# Altium schematic sheet DriverSchematic.SchDoc
size A4; SheetNumber: 2; SheetTotal: 2; SPICEModelCacheHSHRDFLH: <root> / <DocumentId>HSHRDFLH</DocumentId> / <CacheFrame Number="0"> / <Model Name="irf540n" Kind="CKT"> / <Text>.SUBCKT irf540n 1 2 3 / * SPICE3 MODEL WITH THERMAL RC NETWORK / ************************************** / *      Model Generated by MODPEX     * / *Copyright(c) Symmetry Design Systems* / *         All Rights Reserved        * / *    UNPUBLISHED LICENSED SOFTWARE   * / *   Contains Proprietary Information * / *      Which is The Property of      * / *     SYMMETRY OR ITS LICENSORS      * / *Commercial Use or Resale Restricted * / *   by Symmetry License Agreement    * / ************************************** / * Model generated on Sep  5, 01 / * MODEL FORMAT: SPICE3 / * Symmetry POWER MOS Model (Version 1.0) / * External Node Designations / * Node 1 -&gt; Drain / * Node 2 -&gt; Gate / * Node 3 -&gt; Source / M1 9 7 8 8 MM L=100u W=100u / .MODEL MM NMOS LEVEL=1 IS=1e-32 / +VTO=3.58173 LAMBDA=0.00806114 KP=112.25 / +CGSO=1.896e-05 CGDO=1e-11 / RS 8 3 0.025918 / D1 3 1 MD / .MODEL MD D IS=1.565e-11 RS=0.006486 N=1.1328 BV=100 / +IBV=0.00025 EG=1.2 XTI=3.32496 TT=0 / +CJO=1.16e-09 VJ=3.16363 M=0.840542 FC=0.5 / RDS 3 1 1e+06 / RD 9 1 0.0130608 / RG 2 7 6.45271 / D2 4 5 MD1 / * Default values used in MD1: / *   RS=0 EG=1.11 XTI=3.0 TT=0 / *   BV=infinite IBV=1mA / .MODEL MD1 D IS=1e-32 N=50 / +CJO=1.30485e-09 VJ=0.899032 M=0.9 FC=1e-08 / D3 0 5 MD2 / * Default values used in MD2: / *   EG=1.11 XTI=3.0 TT=0 CJO=0 / *   BV=infinite IBV=1mA / .MODEL MD2 D IS=1e-10 N=0.4 RS=3e-06 / RL 5 10 1 / FI2 7 9 VFI2 -1 / VFI2 4 0 0 / EV16 10 0 9 7 1 / CAP 11 10 2.35428e-09 / FI1 7 9 VFI1 -1 / VFI1 11 6 0 / RCAP 6 10 1 / D4 0 6 MD3 / * Default values used in MD3: / *   EG=1.11 XTI=3.0 TT=0 CJO=0 / *   RS=0 BV=infinite IBV=1mA / .MODEL MD3 D IS=1e-10 N=0.4 / .ENDS irf540n</Text> / </Model> / </CacheFrame> / </root>
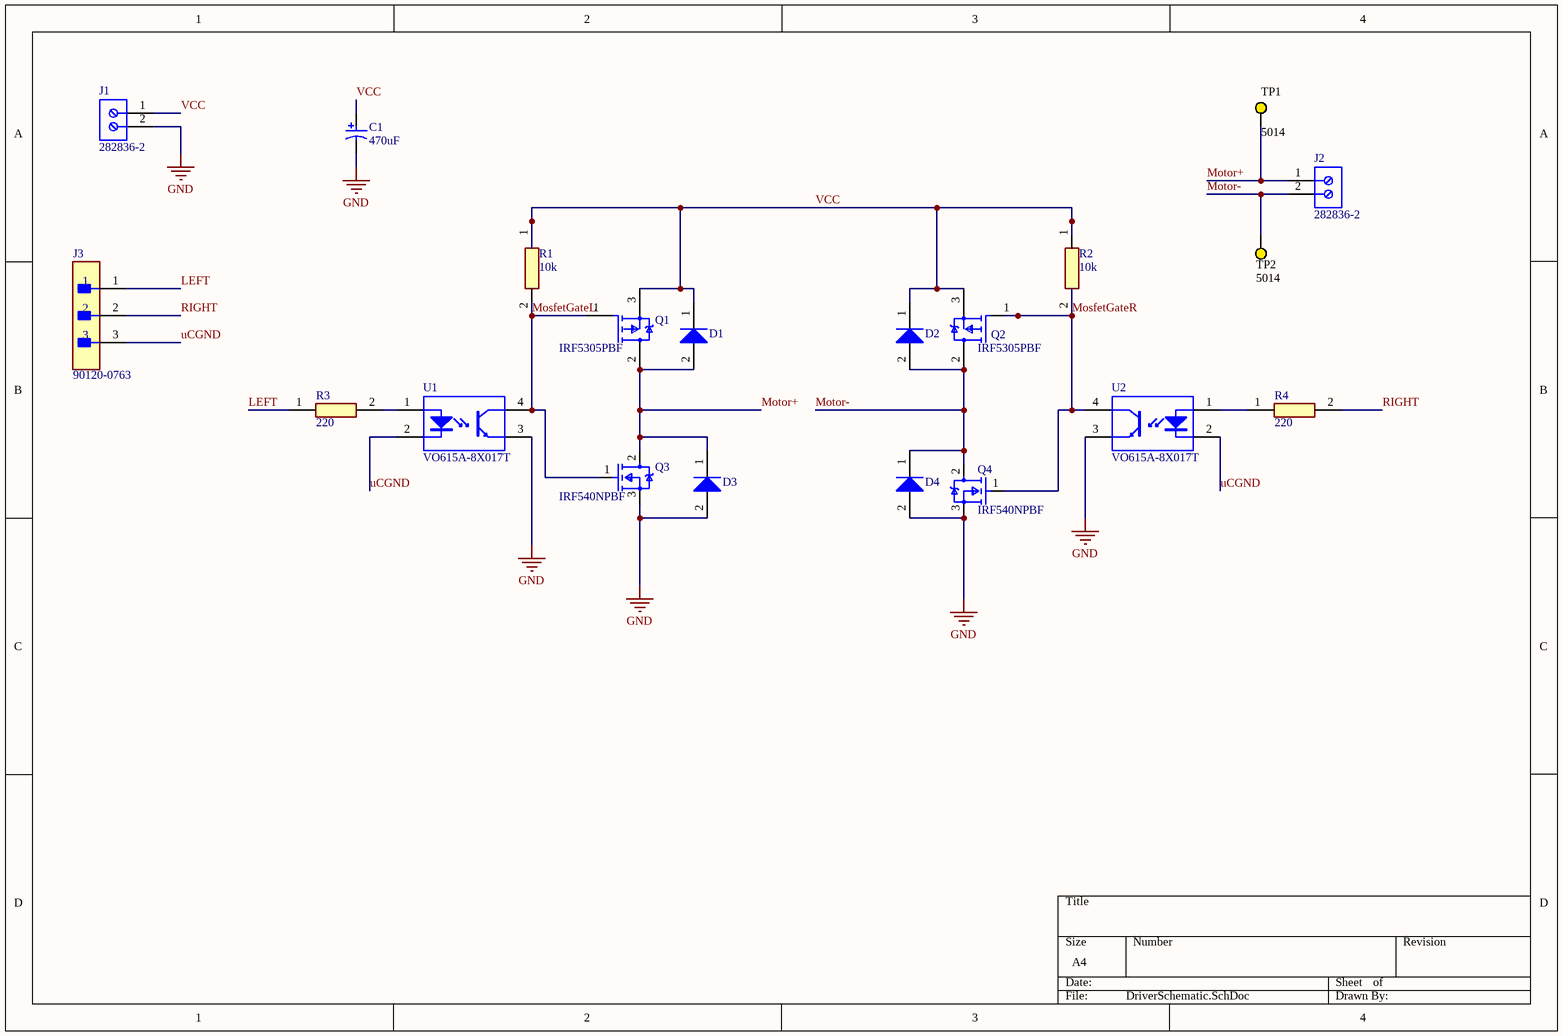
[diagram p0: DriverSchematic.SchDoc]

## Parts
C1  470uF  [PNSC-CAP-10x20-P2]
D1  MUR410RLG  [ONSC-AXIAL_LEAD-2-267-05_V]  (value not drawn)
D2  MUR410RLG  [ONSC-AXIAL_LEAD-2-267-05_V]  (value not drawn)
D3  MUR410RLG  [ONSC-AXIAL_LEAD-2-267-05_V]  (value not drawn)
D4  MUR410RLG  [ONSC-AXIAL_LEAD-2-267-05_V]  (value not drawn)
J1  282836-2  [TECO-282836-2_V]
J2  282836-2  [TECO-282836-2_V]
J3  90120-0763  [FP-90120-0763-MFG]
Q1  IRF5305PBF  [FP-PG-TO220-3-0]
Q2  IRF5305PBF  [FP-PG-TO220-3-0]
Q3  IRF540NPBF  [Infineon_IRF540NPBF_0]
Q4  IRF540NPBF  [Infineon_IRF540NPBF_0]
R1  10k  [RESAD3200W81L1200D500]
R2  10k  [RESAD3200W81L1200D500]
R3  220  [RESAD1650W60L650D250]
R4  220  [RESAD1650W60L650D250]
TP1  5014  [KSTN-5014_V]
TP2  5014  [KSTN-5014_V]
U1  VO615A-8X017T  [VISH-VO615A-XX017T_V]
U2  VO615A-8X017T  [VISH-VO615A-XX017T_V]

## Nets
GND: C1.2 D3.2(A) D4.2(A) J1.2 Q3.3(SOURCE) Q4.3(SOURCE) U1.3(EMITTER) U2.3(EMITTER)
LEFT: J3.1 R3.1
MosfetGateL: Q1.1(G) Q3.1(GATE) R1.2 U1.4(COLLECTOR)
MosfetGateR: Q2.1(G) Q4.1(GATE) R2.2 U2.4(COLLECTOR)
Motor+: D1.2(A) D3.1(K) J2.1 Q1.2(D) Q3.2(DRAIN) TP1.1
Motor-: D2.2(A) D4.1(K) J2.2 Q2.2(D) Q4.2(DRAIN) TP2.1
RIGHT: J3.2 R4.2
uCGND: J3.3 U1.2(CATHODE) U2.2(CATHODE)
VCC: C1.1 D1.1(K) D2.1(K) J1.1 Q1.3(S) Q2.3(S) R1.1 R2.1
NetR3_2: R3.2 U1.1(ANODE)
NetR4_1: R4.1 U2.1(ANODE)

## Library data of the parts
C1 = CMP-2000-05308-1: Aluminum Electrolytic Capacitor, 470 uF, +/- 20%, 50 V, -55 to 105 degC, 2-Pin THD, RoHS, Bulk; Manufacturer: Panasonic; Package Version: Nov-12; Type: Radial; Lifetime@Temperature: 2000Hrs@105degC; Capacitance: 470µF; Rated Voltage: 50V; Ripple Current: 530mA; Case Size/Dimension: Ø10x20mm; Package Reference: CAP-10x20-P2; Package Description: 2-Pin Through Hole Device, Dia 10 mm, Body Length 20 mm, Pin Spacing 5 mm; Series: NHG; Datasheet Version: Nov-12; Datasheet URL: http://www.alliedelec.com/images/products/datasheets/bm/Panasonic/70067776.pdf; Package URL: http://www.alliedelec.com/images/products/datasheets/bm/Panasonic/70067776.pdf; Operating Temp-Max: 105degC; Operating Temp Range: -55to+105degC; Manufacturer URL: http://www.panasonic.com/
D1-D4 = CMP-0902-00013-1: SWITCHMODE(TM) Power Rectifier, 2-Pin Axial_Lead, Pb-Free, Tape and Reel; Manufacturer: On Semiconductor; VRRM Max (V): 100; IFSM Max (A): 125; Type: Ultrafast; PackageReference: AXIAL_LEAD-2-267-05; PackageDescription: 2-Pin, Axial Lead, Diameter 5.05 mm; ComponentLink3Description: Package Specification; ComponentLink3URL: http://www.onsemi.com/pub_link/Collateral/267-05.PDF; PartNumber: MUR410RLG; Mounting Technology: Through Hole; ComponentLink2Description: Datasheet; RoHS: TRUE; ComponentLink1Description: Manufacturer URL; DatasheetVersion: Rev. 15; ComponentLink2URL: http://www.onsemi.cn/pub_link/Collateral/MUR420-D.PDF; PackageVersion: Rev. G, 06/2000; Packing: Tape and Reel; ComponentLink1URL: http://www.onsemi.com/
J1 J2 = CMP-1684-00017-1: Female Header, Pitch 5 mm, 1 x 2 Position, Height 10 mm, Tail Length 3.5 mm, Rohs, Bulk; Manufacturer: TE Connectivity; Wire Gauge: 16-30AWG; Product Training Modules: Wire-to-BoardEurostyleTerminalBlocks; Clamp Material - Plating: Brass-NickelPlated; Voltage: 300V; Mating Orientation: HorizontalwithBoard; Current: 13.5A; Pitch: 0.197"(5.00mm); Screw Thread: M3; 3D Model: 282836-2.pdf; Other Names: 5ULV-02B / A98076; Dynamic Catalog: BuchananSeries; Number of Levels: 1; Torque - Screw: 0.68Nm(6Lb-In); Featured Product: EurostyleTerminalBlockConnectors; Positions Per Level: 2; Wire Termination: Screw-RisingCageClamp; Datasheet URL: http://www.te.com.cn/commerce/DocumentDelivery/DDEController?Action=showdoc&DocId=Catalog+Section%7F1308389_EUROSTYLE_TERMINAL_BLOCKS%7F0607%7Fpdf%7FEnglish%7FENG_CS_1308389_EUROSTYLE_TERMINAL_BLOCKS_0607.pdf%7F282836-2; Color: Green; Family: TerminalBlocks-WiretoBoard; RoHS Information: 282836-2StatementofCompliance; Standard Package: 300; Contact Material - Plating: Brass-TinPlated; Manufacturer URL: http://www.te.com; Housing Material: Polyamide(PA66),Nylon6/6; Features: Interlocking(Side); Package Description: Female Header, Pitch 5 mm, 1 x 2 Position, Height 10 mm, Tail Length 3.5 mm; Mounting Type: ThroughHole; Package Reference: THD; Packaging: Bulk; Series: Buchanan; Category: Connectors,Interconnects; Screw Material - Plating: Brass-NickelPlated
J3 = CMP-04776-000084-1: CONN HEADER VERT 3POS 2.54MM; Manufacturer: Molex; Voltage Rating: 350V; Number Of Contacts: 3; Conn Orientation: Vertical; Current Rating: 3A; Conn Gender: Male; Package: 90120-0763; ComponentLink2Description: Datasheet; Height: 5.8mm; Manufacturer Part Number: 90120-0763; Temperature Range High: +125°C; RoHS: TRUE; ComponentLink2URL: https://www.molex.com/webdocs/datasheets/pdf/en-us/0901200763_PCB_HEADERS.pdf; Device Class L2: Headers and Wire Housings; Temperature: -55°C to +125°C; Device Class L1: Connectors; Pitch: 2.54mm; Footprint Url: https://www.molex.com/pdm_docs/sd/901200763_sd.pdf; Device Class L3: unset; Temperature Range Low: -55°C; Number Of Rows: 1; Category: Conn; Lead Free: Yes; Mouser Description: Board-To-Board Connector, C-Grid III 90120 Series, Through Hole, Header, 3, 2.54 mm; Octopart: https://octopart.com/90120-0763-molex-655433; Contact Material: Gold,Nickel; Automotive: No; Digikey Description: CONN HEADER VERT 3POS 2.54MM
Q1 Q2 = CMP-32901-000003-1: MOSFET P-CH 55V 31A TO-220AB; Manufacturer: Infineon; Max Forward Diode Voltage: -1.3V; Continuous Drain Current: -31A; Standoff Height: 3.55mm; Power Dissipation: 110W; Number Of Channels: 1; Rthja Max: 62°C/W; Depletion Mode: False; Drain To Source Resistance: 0.06Ω; Input Capacitace At Vds: 1200pF @ -25V; Reverse Recovery Time: 71ns; Gate Charge At Vgs: 63nC @ -10V; Gate To Source Voltage: 20V; Turn Off Delay Time: 39ns; Turn On Delay Time: 14ns; Drain To Source Breakdown Voltage: -55V; Threshold Vgs Min: -2V; Max Junction Temp: +175°C; Pulse Drain Current: -110A; Reverse Recovery Charge: 170nC; Threshold Vgs Max: -4V; Device Class L1: Discrete Semiconductors; Lead Free: Yes; Temperature Range High: +175°C; Device Class L2: Transistors; Package: PG-TO220-3; Octopart: https://octopart.com/irf5305pbf-infineon-65873396; RoHS: TRUE; Number Of P Channels: 1; Manufacturer Part Number: IRF5305PBF; Category: Trans; Digikey Description: MOSFET P-CH 55V 31A TO-220AB; Device Class L3: MOSFETs; Height: 19.3mm; Automotive: No; Temperature Range Low: -55°C; Temperature: -55°C to +175°C; ComponentLink2URL: https://www.infineon.com/dgdl/irf5305pbf.pdf?fileId=5546d462533600a4015355e370101993; Drain To Source Voltage: -55V; ComponentLink2Description: Datasheet
Q3 Q4 = Trans_Infineon_IRF540NPBF_eec: TRANS MOSFET N-CH 100V 33A TO-220AB; Vgs (Max): ±20V; Power Dissipation (Max): 130W; Part Number: IRF540NPBF; helpURL: https://upverter.com/upn/revision/62782e0a3528cc6f/; ComponentLink2Description: Datasheet; Temperature: -55°C to +175°C; Package: TO-220AB; Supplier 2: Mouser; Price: 0.985460972103; Supplier 1: Digi-Key; ComponentLink1URL: https://upverter.com/upn/revision/62782e0a3528cc6f/; Supplier Part Number 2: 942-IRF540NPBF; Supplier Part Number 1: IRF540NPBF-ND; Manufacturer: Infineon; ComponentLink1Description: Upverter; ComponentLink2URL: https://upverter.com/datasheet/5308f6ed8ea707896f3dcb9c5bff2bbed3412a6b.pdf; RoHS: TRUE; Mouser Part Number: 942-IRF540NPBF; Ipc Land Pattern Name: TO-220; Temperature Range High: +175°C; Digikey Description: TRANS MOSFET N-CH 100V 33A TO-220AB; Digikey Part Number: IRF540NPBF-ND; Lead Free: yes; Temperature Range Low: -55°C; Current - Continuous Drain (Id) @ 25°C: 33A
R1 R2 = OM1035E-R58: Resistor; Manufacturer_Name: Ohmite; Datasheet Link: https://www.mouser.com/datasheet/2/942/SF_AGH_Series-1508337.pdf; Manufacturer_Part_Number: OM1035E-R58; Mouser Part Number: 588-OM1035E-R58; Mouser Price/Stock: https://www.mouser.co.uk/ProductDetail/Ohmite/OM1035E-R58?qs=AkUtuiJmyfk0HzUJmzHVdA%3D%3D
R3 R4 = MRS25000C2200FCT00: Resistor; Manufacturer_Name: Vishay; Datasheet Link: http://www.vishay.com/docs/28724/mrs16m25.pdf; Manufacturer_Part_Number: MRS25000C2200FCT00; Mouser Part Number: 594-MRS25000C2200FCT; Mouser Price/Stock: https://www.mouser.co.uk/ProductDetail/Vishay-BC-Components/MRS25000C2200FCT00?qs=VfXS90KdVcZ%2FSi5qHqznqg%3D%3D; Arrow Part Number: MRS25000C2200FCT00; Arrow Price/Stock: https://www.arrow.com/en/products/mrs25000c2200fct00/vishay
TP1 TP2 = CMP-1672-00006-4: Test Point, Yellow, Through Hole, RoHS, Bulk; Manufacturer: Keystone; PackageDescription: 1-Pin Through Hole Device, Dia 3.17 mm; REACH SVHC: No SVHC; ComponentLink2Description: Datasheet; ComponentLink2URL: http://www.keyelco.com/product-pdf.cfm?p=1323; Package Quantity: 100; Colour: Yellow; Height: 8.12 mm; RoHSCompliant: true; Contact Material: Bronze; Mount: Through Hole; Contact Plating: Silver; ComponentLink1URL: http://www.keyelco.com/; Packaging: Bulk; Mounting Technology: Through Hole; PackageReference: 5014; ComponentLink1Description: Manufacturer URL; DatasheetVersion: Rev. F, 12/2013
U1 U2 = CMP-2000-07399-1: Optocoupler, Phototransistor Output, High Temperature, 5000 VRMS, -55 to 110 degC, 4-Pin SMD, RoHS, Tape and Reel; Manufacturer: Vishay; Vce Saturation (Max): 300mV; Turn On / Turn Off Time (Typ): 6µs,5µs; Minimum Quantity: 1; Other Names: VO615A-8X017TDKR; Current - Output / Channel: 50mA; Current - DC Forward (If): 60mA; Voltage - Forward (Vf) (Typ): 1.43V; Current Transfer Ratio (Max): 260%@5mA; Input Type: DC; Dynamic Catalog: VOS615A,VOS617A,VOS618ASeries; Rise / Fall Time (Typ): 3µs,4.7µs; Current Transfer Ratio (Min): 130%@5mA; Voltage - Output (Max): 70V; Packaging: Digi-Reel®; Package Description: 4-Pin Surface Mount Device, Body 6.5 x 4.58 mm, Pitch 2.54 mm; Voltage - Isolation: 5000Vrms; Standard Package: 1; Category: Isolators; Output Type: Transistor; Datasheet URL: http://www.vishay.com/docs/81753/vo615a.pdf; Manufacturer URL: http://www.vishay.com/; Quantity Available: Tape&Reel(TR)AlternatePackaging; Package/Case: 4-SMD,GullWing; Operating Temperature: -55°C~110°C; Supplier Device Package: 4-SMD; Family: Optoisolators-Transistor,PhotovoltaicOutput; Current - DC Forward (If) (Max): 60mA; Package Reference: VO615A-XX017T; Datasheet Version: Rev. 2.2, 09/2013; Package / Case: 4-SMD,GullWing; Mounting Type: SurfaceMount; Mounting Technology: SurfaceMount; Number of Channels: 1; Voltage - Output: 70V